# Altium schematic sheet Schematic Band Pass.SchDoc
size A4; SheetNumber: 1; SheetTotal: 2
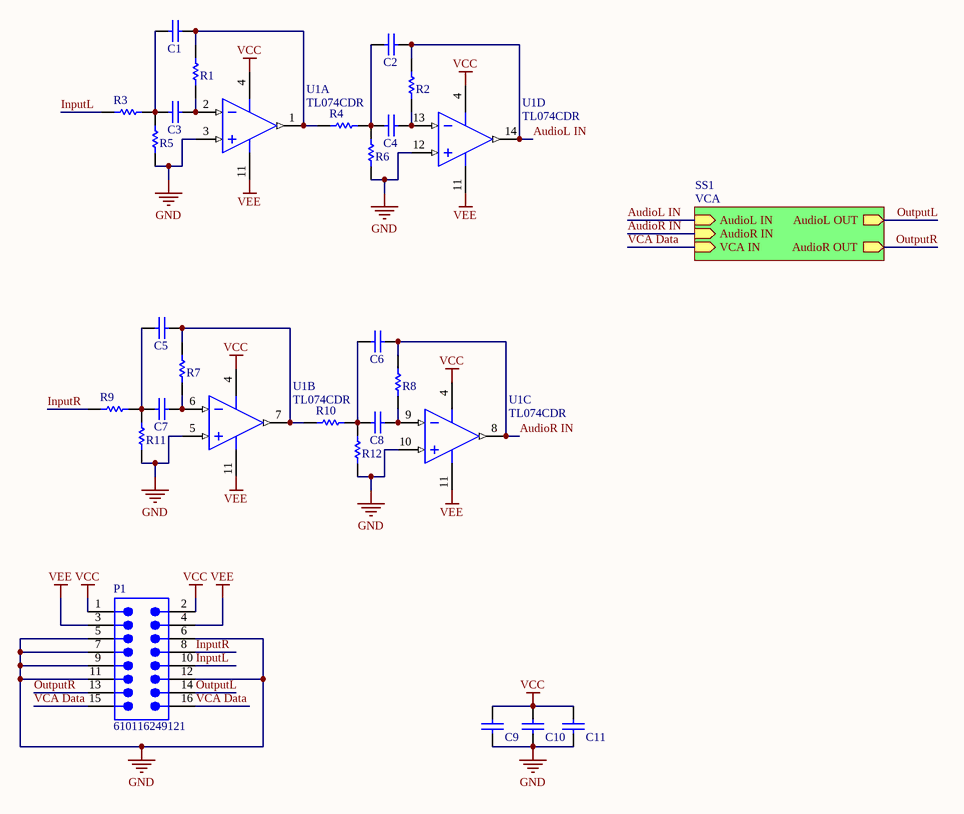
[diagram p0: Schematic Band Pass.SchDoc]

## Parts
C1  1206GC102KAT1A  [AVX-1206-2_L]  (value not drawn)
C2  1206GC102KAT1A  [AVX-1206-2_L]  (value not drawn)
C3  1206GC102KAT1A  [AVX-1206-2_L]  (value not drawn)
C4  1206GC102KAT1A  [AVX-1206-2_L]  (value not drawn)
C5  1206GC102KAT1A  [AVX-1206-2_L]  (value not drawn)
C6  1206GC102KAT1A  [AVX-1206-2_L]  (value not drawn)
C7  1206GC102KAT1A  [AVX-1206-2_L]  (value not drawn)
C8  1206GC102KAT1A  [AVX-1206-2_L]  (value not drawn)
C9  1206GC102KAT1A  [AVX-1206-2_L]  (value not drawn)
C10  1206GC102KAT1A  [AVX-1206-2_L]  (value not drawn)
C11  1206GC102KAT1A  [AVX-1206-2_L]  (value not drawn)
P1  610116249121  [610116249121]
R1  ERJ-8GEY0R00V  [RESC3216X70X50NL05T20]  (value not drawn)
R2  ERJ-8GEY0R00V  [RESC3216X70X50NL05T20]  (value not drawn)
R3  ERJ-8GEY0R00V  [RESC3216X70X50NL05T20]  (value not drawn)
R4  ERJ-8GEY0R00V  [RESC3216X70X50NL05T20]  (value not drawn)
R5  ERJ-8GEY0R00V  [RESC3216X70X50NL05T20]  (value not drawn)
R6  ERJ-8GEY0R00V  [RESC3216X70X50NL05T20]  (value not drawn)
R7  ERJ-8GEY0R00V  [RESC3216X70X50NL05T20]  (value not drawn)
R8  ERJ-8GEY0R00V  [RESC3216X70X50NL05T20]  (value not drawn)
R9  ERJ-8GEY0R00V  [RESC3216X70X50NL05T20]  (value not drawn)
R10  ERJ-8GEY0R00V  [RESC3216X70X50NL05T20]  (value not drawn)
R11  ERJ-8GEY0R00V  [RESC3216X70X50NL05T20]  (value not drawn)
R12  ERJ-8GEY0R00V  [RESC3216X70X50NL05T20]  (value not drawn)
U1  TL074CDR  [D0014A_N]  (parts A,B,C,D of 4)

## Sub-sheets
SS1 = VCA: AudioR IN (in), AudioL IN (in), VCA IN (in), AudioL OUT (out), AudioR OUT (out)

## Nets
GND: C9.1 C10.1 C11.1 P1.5 P1.6 P1.7 P1.9 P1.11 P1.12 R5.1 R6.1 R11.1 R12.1 U1.3(IN1+) U1.5(IN2+) U1.10(IN3+) U1.12(IN4+)
VCC: C9.2 C10.2 C11.2 P1.1 P1.2 U1.4(VCC+)
VEE: P1.3 P1.4 U1.11(VCC-)
AudioL IN: C2.2 R2.2 U1.14(OUT4) ; sheet SS1/AudioL IN
AudioR IN: C6.2 R8.2 U1.8(OUT3) ; sheet SS1/AudioR IN
InputL: P1.10 R3.1
InputR: P1.8 R9.1
OutputL: P1.14 ; sheet SS1/AudioL OUT
OutputR: P1.13 ; sheet SS1/AudioR OUT
VCA Data: P1.15 P1.16 ; sheet SS1/VCA IN
NetC1_1: C1.1 C3.1 R3.2 R5.2
NetC1_2: C1.2 R1.2 R4.1 U1.1(OUT1)
NetC2_1: C2.1 C4.1 R4.2 R6.2
NetC3_2: C3.2 R1.1 U1.2(IN1-)
NetC4_2: C4.2 R2.1 U1.13(IN4-)
NetC5_1: C5.1 C7.1 R9.2 R11.2
NetC5_2: C5.2 R7.2 R10.1 U1.7(OUT2)
NetC6_1: C6.1 C8.1 R10.2 R12.2
NetC7_2: C7.2 R7.1 U1.6(IN2-)
NetC8_2: C8.2 R8.1 U1.9(IN3-)

## Library data of the parts
C1-C11 = CMP-2000-05468-1: Chip Capacitor, 1 nF, +/- 10%, -55 to 125 degC, 1206 (3216 Metric), RoHS, Tape and Reel; Manufacturer: AVX; Capacitance: 0.001uF; Dielectric: X7R; Voltage Rating DC: 2000V; Package Reference: 1206; Datasheet Version: 11/2010; Mounting Technology: SurfaceMount; Manufacturer URL: http://www.avx.com/; Tolerance: 10%; Tolerance (%): ±10%; PartNumber: 1206GC102KAT1A; Datasheet URL: https://datasheet.ciiva.com/11787/0900766b80ed4c37-11787781.pdf; Package Description: 2-Pin SMD, Body 3.4 x 1.8 mm; Case Size/Dimension: 1206; Rated Voltage: 2000V
P1 = CMP-1502-01151-2: NexarPartId: 52645099; Gender: Male; Number of Contacts: 16; Contact Resistance: 20mΩ; Row Spacing: 2.54mm; Operating Supply Voltage: 250V; Current Rating: 3A; Connector Type: Male Pin; REACH SVHC: Unknown; Termination: Solder; Number of Rows: 2; Packaging: Tape and Reel; Color: Black; Number of Pins: 16; Contact Plating: Gold; Mount: Surface Mount; Pitch: 2.54mm; Number of Positions: 16; Lead Pitch: 2.54mm; Contact Mating Length: 5.9944mm; RoHS: Compliant
R1-R12 = CMP-2003-00541-1: Manufacturer: Panasonic; Part Number: ERJ-8GEY0R00V
U1 = CMP-0017-00003-2: Quad Low-Noise JFET-Input General-Purpose Operational Amplifier, 7 to 36 V, 0 to 70 degC, 14-pin SOIC (D14), Green (RoHS & no Sb/Br); Manufacturer: Texas Instruments; Slew Rate(Typ)(V/us): 13; IIB(Max)(pA): 200; Number of Channels: 4; CMRR(Min)(dB): 70; Vn at 1kHz(Typ)(nV/rtHz): 18; Vio (25C)(Max)(mV): 10; Sub Family: General Purpose Amplifier, High Supply Voltage Amplifier (>=30V); Total Supply Voltage(Max)(+5V is 5, +/-5V is 10): 36; Total Supply Voltage(Min)(+5V is 5, +/-5V is 10): 7; GBW(Typ)(MHz): 3; Rating: Military; Iq per channel(Max)(mA): 2.5; Eco-Plan: Green (RoHS & no Sb/Br); ComponentLink3Description: Package Specification; ComponentLink1URL: http://www.ti.com/; Mounting Technology: Surface Mount; ComponentLink3URL: http://www.ti.com/lit/ml/mpds177g/mpds177g.pdf; PartNumber: TL074CDR; DatasheetVersion: SLOS080J; ComponentLink2URL: http://www.ti.com/lit/ds/symlink/tl074.pdf; ComponentLink1Description: Manufacturer URL; PackageVersion: 4040047-5/M, 06/2011; PackageReference: D0014A; Code_JEDEC: MS-012; ComponentLink2Description: Datasheet; Offset Drift(Typ)(uV/C): 18; PackageDescription: 14-Pin Plastic Small Outline, Body 8.65 x 3.90 mm, Pitch 1.27 mm